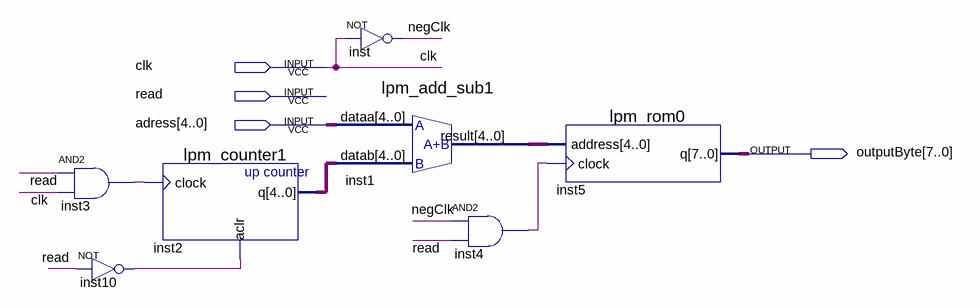
[diagram p0: schematic sheet]
// Quartus schematic Rom.bdf as structural Verilog: 7 symbols, 4 pins
module Rom (
  input  clk,
  input  read,
  input  [4:0] adress,
  output [7:0] outputByte
);

  wire inst3_out, inst4_out, inst10_out, negClk;
  wire [4:0] inst1_result, inst2_q;

  and inst3 (inst3_out, read, clk);
  not inst10 (inst10_out, read);
  lpm_counter1 inst2 (.clock(inst3_out), .aclr(inst10_out), .q(inst2_q));
  not inst (negClk, clk);
  lpm_add_sub1 inst1 (.dataa(adress), .datab(inst2_q), .result(inst1_result));
  and inst4 (inst4_out, negClk, read);
  lpm_rom0 inst5 (.address(inst1_result), .clock(inst4_out), .q(outputByte));
endmodule
